# Altium schematic sheet nanobase.SchDoc
size A4
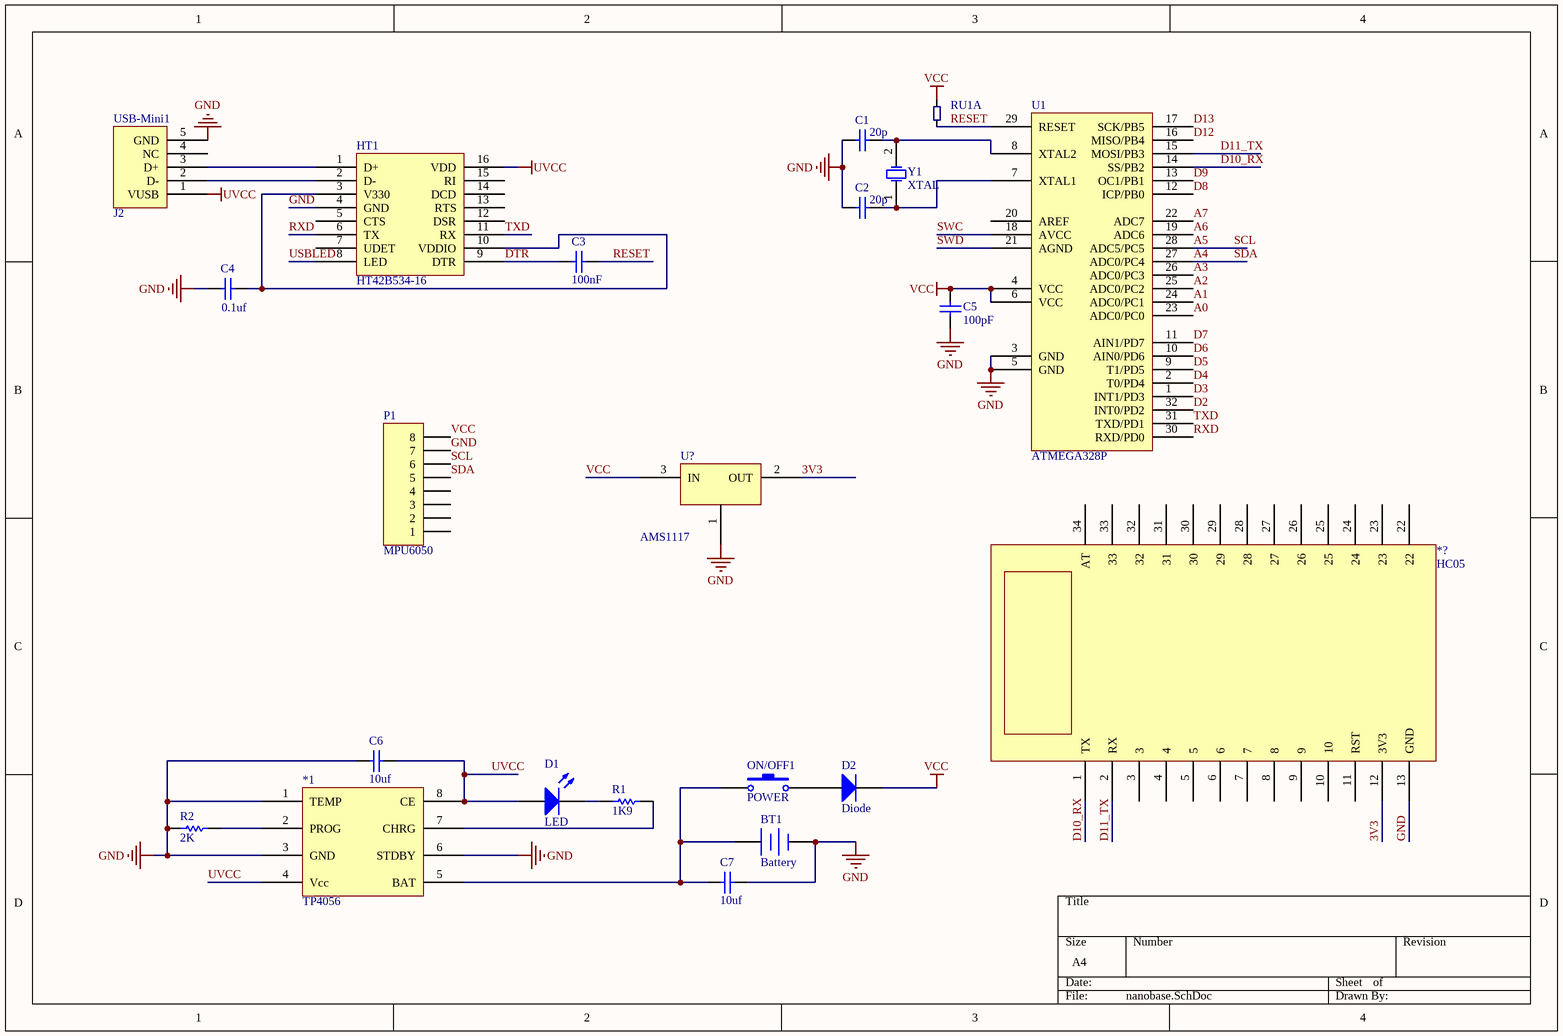
[diagram p0: nanobase.SchDoc]

## Parts
*1  TP4056  [SOP_8]
*?  HC05  [HC-05 天线]
BT1  Battery  [HDR1X2]
C1  value 20p  [1206z]  (hidden comment: Cap)
C2  value 20p  [1206z]  (hidden comment: Cap)
C3  value 100nF  [1206z]  (hidden comment: Cap)
C4  value 0.1uf  [1206z]  (hidden comment: Cap)
C5  value 100pF  [1206z]  (hidden comment: Cap)
C6  value 10uf  [1206z]  (hidden comment: Cap)
C7  value 10uf  [1206z]  (hidden comment: Cap)
D1  LED  [1206_极性]
D2  Diode  [1206_极性]
HT1  HT42B534-16  [SOP_16]
ON/OFF1  POWER  [Switch1]
P1  MPU6050  [HDR1X8]
R1  value 1K9  [1206z]  (hidden comment: Resistor)
R2  value 2K  [1206z]  (hidden comment: Resistor)
RU1  RES  [1206z]  (value not drawn)  (part A of 4)
U1  ATMEGA328P  [TQFP_32_短PIN]
U?  AMS1117  [SOT_223]
USB-Mini1  J2  [USB-MicroDIP4]
Y1  XTAL  [XTAL_5032_2PIN]

## Nets
GND: *1.1(TEMP) *1.3(GND) *1.6(STDBY) *?.13(GND) BT1.2(-) C1.2 C2.2 C4.2 C5.2 C6.1 C7.2 HT1.4(GND) P1.7 R2.2 U1.3(GND) U1.5(GND) U?.1(GND) USB-Mini1.5(GND)
UVCC: *1.4(Vcc) *1.8(CE) C6.2 D1.1(IN) HT1.16(VDD) USB-Mini1.1(VUSB)
VCC: C5.1 D2.2(OUT) P1.8 RU1.1 U1.4(VCC) U1.6(VCC) U?.3(IN)
3V3: *?.12(3V3) U?.2(OUT)
A0: U1.23(ADC0/PC0)
A1: U1.24(ADC0/PC1)
A2: U1.25(ADC0/PC2)
A3: U1.26(ADC0/PC3)
A4: P1.5 U1.27(ADC0/PC4)  [also labelled SDA]
A5: P1.6 U1.28(ADC5/PC5)  [also labelled SCL]
A6: U1.19(ADC6)
A7: U1.22(ADC7)
D2: U1.32(INT0/PD2)
D3: U1.1(INT1/PD3)
D4: U1.2(T0/PD4)
D5: U1.9(T1/PD5)
D6: U1.10(AIN0/PD6)
D7: U1.11(AIN1/PD7)
D8: U1.12(ICP/PB0)
D9: U1.13(OC1/PB1)
D10_RX: *?.1(TX) U1.14(SS/PB2)
D11_TX: *?.2(RX) U1.15(MOSI/PB3)
D12: U1.16(MISO/PB4)
D13: U1.17(SCK/PB5)
DTR: C3.1 HT1.9(DTR)
RESET: C3.2 RU1.2 U1.29(RESET)
RXD: HT1.6(TX) U1.30(RXD/PD0)
SWC: U1.18(AVCC)
SWD: U1.21(AGND)
TXD: HT1.11(RX) U1.31(TXD/PD1)
USBLED: HT1.8(LED)
Net*1_2: *1.2(PROG) R2.1
Net*1_5: *1.5(BAT) BT1.1(+) C7.1 ON/OFF1.1
Net*1_7: *1.7(CHRG) R1.1
NetC1_1: C1.1 U1.8(XTAL2) Y1.2(OSC2)
NetC2_1: C2.1 U1.7(XTAL1) Y1.1(OSC1)
NetC4_1: C4.1 HT1.3(V330) HT1.10(VDDIO)
NetD1_2: D1.2(OUT) R1.2
NetD2_1: D2.1(IN) ON/OFF1.2
NetHT1_1: HT1.1(D+) USB-Mini1.3(D+)
NetHT1_2: HT1.2(D-) USB-Mini1.2(D-)

Not connected (* = marked no-connect by the designer): *? 3 4 5 6 7 8 9 10 11(RST) 22 23 24 25 26 27 28 29 30 31 32 33 34(AT); HT1 5(CTS) 7(UDET) 12(DSR) 13(RTS) 14(DCD) 15(RI); P1 1 2 3 4; U1 20(AREF); USB-Mini1 4(NC)

## Library data of the parts
BT1 = Battery: 电池; Published: 24-Mar-1999; LatestRevisionDate: 17-Jul-2002; LatestRevisionNote: Re-released for DXP Platform.; PackageReference: BAT-2; Publisher: Altium Limited; PackageDescription: Battery; 2 Leads
C1-C5 = Cap: Capacitor; Published: 8-Jun-2000; LatestRevisionDate: 17-Jul-2002; LatestRevisionNote: Re-released for DXP Platform.; PackageReference: RAD-0.3; Publisher: Altium Limited
C6 C7 = Cap: 电容; Published: 8-Jun-2000; LatestRevisionDate: 17-Jul-2002; LatestRevisionNote: Re-released for DXP Platform.; PackageReference: RAD-0.3; Publisher: Altium Limited; PackageDescription: Radial Cap, Thru-Hole; 2 Leads; 0.3 in Pin Spacing
D1 = LED: 二极管; Published: 8-Jun-2000; LatestRevisionDate: 08-Jul-2005; LatestRevisionNote: Mech Layer 1 removed.; PackageReference: LED-1; Publisher: Altium Limited; PackageDescription: LED; 2 Leads
D2 = Diode: 二极管; Published: 8-Jun-2000; LatestRevisionDate: 17-Jul-2002; LatestRevisionNote: Re-released for DXP Platform.; PackageVersion: Sep-1996; PackageReference: SMC; Publisher: Altium Limited; PackageDescription: DO-214-AB/SMC; 2 C-Bend Leads; Body 7.9 x 5.9 mm, inc. leads (LxW); Code_JEDEC: DO-214-AB
HT1 = HT42B534-16: USB_COM
ON/OFF1 = SW2_1: 按键; Published: 24-Mar-1999; LatestRevisionDate: 17-Jul-2002; LatestRevisionNote: Re-released for DXP Platform.; PackageReference: SPST-2; Publisher: Altium Limited; PackageDescription: Switch; 2 Leads
P1 = Header 8: Header, 8-Pin; LatestRevisionDate: 17-Jul-2002; LatestRevisionNote: Re-released for DXP Platform.; Publisher: Altium Limited
R1 R2 = Resistor: 电阻; Published: 8-Jun-2000; LatestRevisionDate: 17-Jul-2002; LatestRevisionNote: Re-released for DXP Platform.; PackageReference: AXIAL-0.3; Publisher: Altium Limited; PackageDescription: Axial Device, Thru-Hole; 2 Leads; 0.3 in Pin Spacing
RU1 = RES-8P4R
U1 = atmega328p-au
U? = AMS1117: 稳压
USB-Mini1 = USB_MINI
Y1 = XTAL: Crystal Oscillator; Published: 8-Jun-2000; LatestRevisionDate: 17-Jul-2002; LatestRevisionNote: Re-released for DXP Platform.; PackageReference: R38; Publisher: Altium Limited